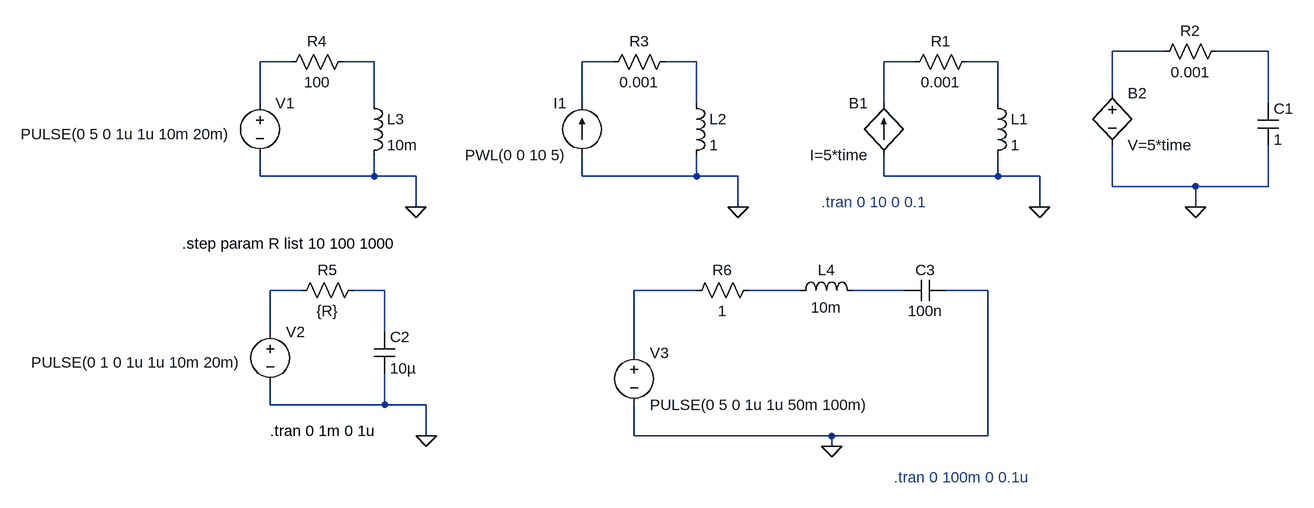
[diagram p0: schematic SIMULACION-LC.asc]
SIMULACION-LC.asc, the LTspice schematic file:
Version 4.1
SHEET 1 880 720
WIRE 512 48 432 48
WIRE 672 48 592 48
WIRE -832 64 -880 64
WIRE -704 64 -752 64
WIRE -336 64 -384 64
WIRE -208 64 -256 64
WIRE 128 64 80 64
WIRE 256 64 208 64
WIRE 432 112 432 48
WIRE -880 128 -880 64
WIRE -704 128 -704 64
WIRE -384 128 -384 64
WIRE -208 128 -208 64
WIRE 80 128 80 64
WIRE 256 128 256 64
WIRE 672 128 672 48
WIRE -880 240 -880 208
WIRE -704 240 -704 208
WIRE -704 240 -880 240
WIRE -640 240 -704 240
WIRE -384 240 -384 208
WIRE -208 240 -208 208
WIRE -208 240 -384 240
WIRE -144 240 -208 240
WIRE 80 240 80 208
WIRE 256 240 256 208
WIRE 256 240 80 240
WIRE 320 240 256 240
WIRE 432 256 432 192
WIRE 560 256 432 256
WIRE 672 256 672 192
WIRE 672 256 560 256
WIRE -640 288 -640 240
WIRE -144 288 -144 240
WIRE 320 288 320 240
WIRE 560 288 560 256
WIRE -816 416 -864 416
WIRE -688 416 -736 416
WIRE -208 416 -304 416
WIRE -48 416 -128 416
WIRE 112 416 32 416
WIRE 240 416 176 416
WIRE -864 480 -864 416
WIRE -688 480 -688 416
WIRE -304 512 -304 416
WIRE -864 592 -864 560
WIRE -688 592 -688 544
WIRE -688 592 -864 592
WIRE -624 592 -688 592
WIRE -624 640 -624 592
WIRE -304 640 -304 592
WIRE 0 640 -304 640
WIRE 240 640 240 416
WIRE 240 640 0 640
WIRE 0 656 0 640
FLAG 320 288 0
FLAG 560 288 0
FLAG -144 288 0
FLAG -640 288 0
FLAG -624 640 0
FLAG 0 656 0
DATAFLAG -720 64 ""
DATAFLAG -208 80 ""
DATAFLAG -704 96 ""
DATAFLAG -688 432 ""
DATAFLAG -304 416 ""
SYMBOL ind 240 112 R0
SYMATTR InstName L1
SYMATTR Value 1
SYMATTR SpiceLine Rser=0.001
SYMBOL bi 80 208 R180
WINDOW 0 24 80 Left 2
WINDOW 3 24 0 Left 2
SYMATTR InstName B1
SYMATTR Value I=5*time
SYMBOL res 224 48 R90
WINDOW 0 0 56 VBottom 2
WINDOW 3 32 56 VTop 2
SYMATTR InstName R1
SYMATTR Value 0.001
SYMBOL res 608 32 R90
WINDOW 0 0 56 VBottom 2
WINDOW 3 32 56 VTop 2
SYMATTR InstName R2
SYMATTR Value 0.001
SYMBOL cap 656 128 R0
SYMATTR InstName C1
SYMATTR Value 1
SYMBOL bv 432 96 R0
SYMATTR InstName B2
SYMATTR Value V=5*time
SYMBOL ind -224 112 R0
SYMATTR InstName L2
SYMATTR Value 1
SYMATTR SpiceLine Rser=0.001
SYMBOL res -240 48 R90
WINDOW 0 0 56 VBottom 2
WINDOW 3 32 56 VTop 2
SYMATTR InstName R3
SYMATTR Value 0.001
SYMBOL current -384 208 R180
WINDOW 0 24 80 Left 2
WINDOW 3 24 0 Left 2
WINDOW 123 0 0 Left 0
WINDOW 39 0 0 Left 0
SYMATTR InstName I1
SYMATTR Value PWL(0 0 10 5)
SYMBOL ind -720 112 R0
SYMATTR InstName L3
SYMATTR Value 10m
SYMATTR SpiceLine Rser=0.001
SYMBOL res -736 48 R90
WINDOW 0 0 56 VBottom 2
WINDOW 3 32 56 VTop 2
SYMATTR InstName R4
SYMATTR Value 100
SYMBOL voltage -880 112 R0
WINDOW 3 -368 63 Left 2
WINDOW 123 0 0 Left 0
WINDOW 39 0 0 Left 0
SYMATTR Value PULSE(0 5 0 1u 1u 10m 20m)
SYMATTR InstName V1
SYMBOL res -720 400 R90
WINDOW 0 0 56 VBottom 2
WINDOW 3 32 56 VTop 2
SYMATTR InstName R5
SYMATTR Value {R}
SYMBOL voltage -864 464 R0
WINDOW 3 -368 63 Left 2
WINDOW 123 0 0 Left 0
WINDOW 39 0 0 Left 0
SYMATTR Value PULSE(0 1 0 1u 1u 10m 20m)
SYMATTR InstName V2
SYMBOL cap -704 480 R0
SYMATTR InstName C2
SYMATTR Value 10µ
SYMBOL ind -64 432 R270
WINDOW 0 32 56 VTop 2
WINDOW 3 5 56 VBottom 2
SYMATTR InstName L4
SYMATTR Value 10m
SYMBOL cap 112 432 R270
WINDOW 0 32 32 VTop 2
WINDOW 3 0 32 VBottom 2
SYMATTR InstName C3
SYMATTR Value 100n
SYMBOL res -112 400 R90
WINDOW 0 0 56 VBottom 2
WINDOW 3 32 56 VTop 2
SYMATTR InstName R6
SYMATTR Value 1
SYMBOL voltage -304 496 R0
WINDOW 123 0 0 Left 0
WINDOW 39 0 0 Left 0
SYMATTR InstName V3
SYMATTR Value PULSE(0 5 0 1u 1u 50m 100m)
TEXT -16 280 Left 2 ;.tran 0 10 0 0.1
TEXT -864 632 Left 2 !.tran 0 1m 0 1u
TEXT 96 704 Left 2 ;.tran 0 100m 0 0.1u
TEXT -1000 344 Left 2 !.step param R list 10 100 1000

The netlist it stands for:
* SIMULACION-LC.asc
L1 N008 0 1 Rser=0.001
B1 0 N007 I=5*time
R1 N008 N007 0.001
R2 N002 N001 0.001
C1 N002 0 1
B2 N001 0 V=5*time
L2 N006 0 1 Rser=0.001
R3 N006 N005 0.001
I1 0 N005 PWL(0 0 10 5)
L3 N004 0 10m Rser=0.001
R4 N004 N003 100
V1 N003 0 PULSE(0 5 0 1u 1u 10m 20m)
R5 N010 N009 {R}
V2 N009 0 PULSE(0 1 0 1u 1u 10m 20m)
C2 N010 0 10µ
L4 N012 N013 10m
C3 N013 0 100n
R6 N012 N011 1
V3 N011 0 PULSE(0 5 0 1u 1u 50m 100m)
* .tran 0 10 0 0.1
.tran 0 1m 0 1u
* .tran 0 100m 0 0.1u
.step param R list 10 100 1000
.backanno
.end